# Altium schematic sheet sch_cm4_usb.SchDoc
size A4; SheetNumber: 7; SheetTotal: 7
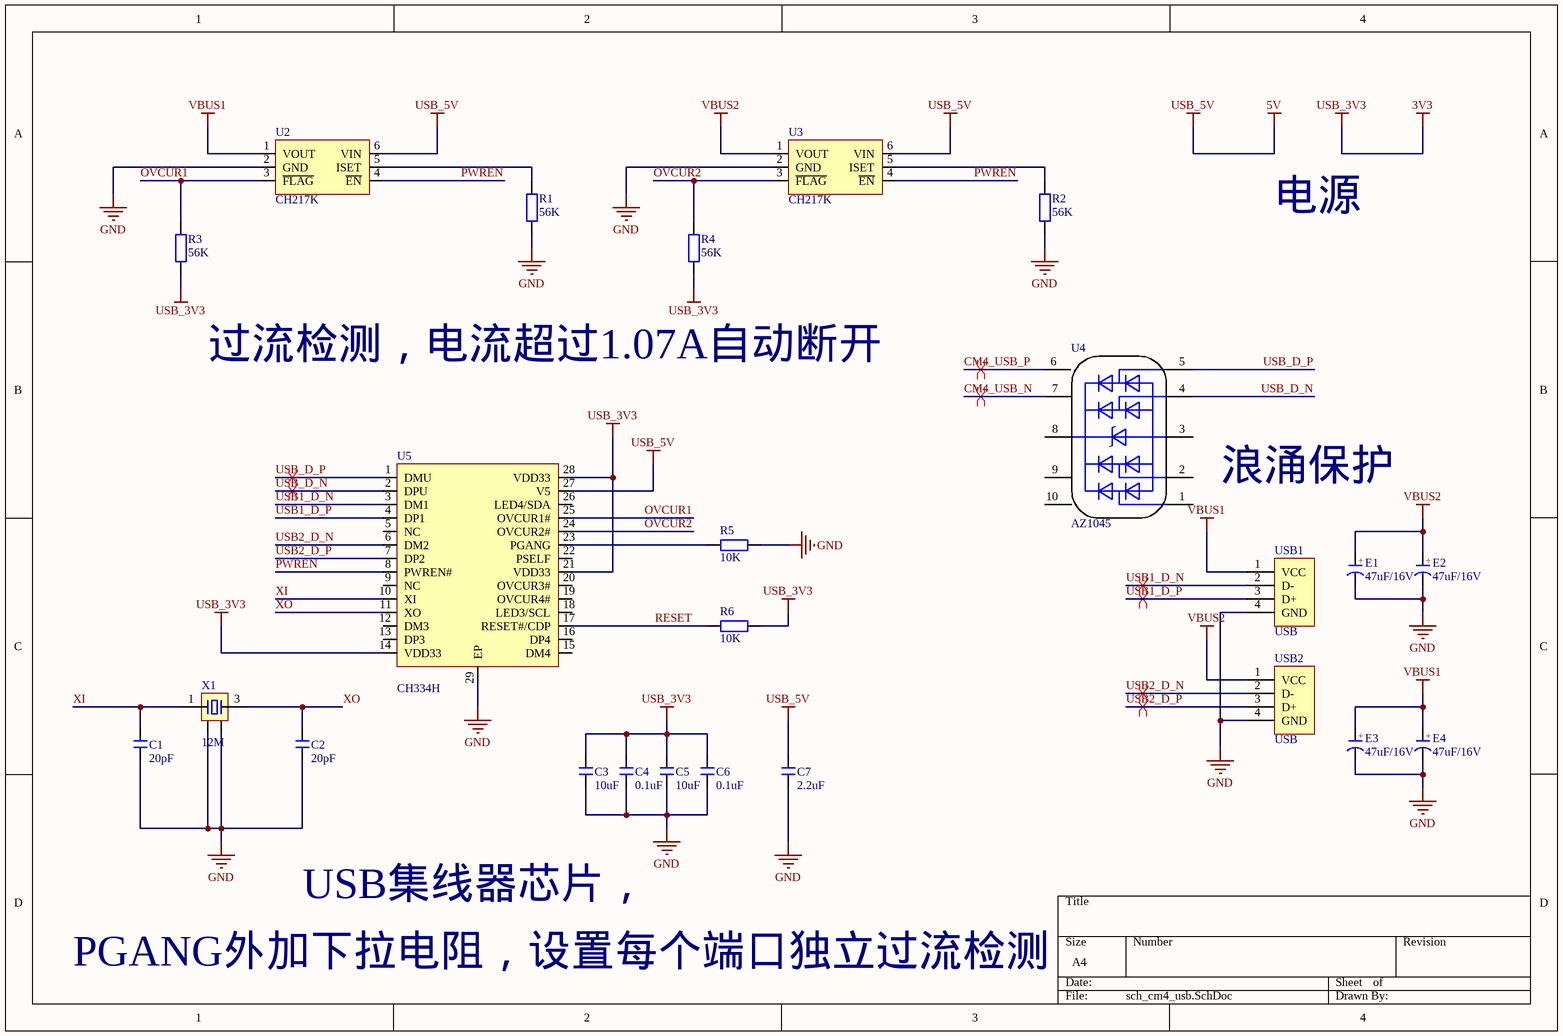
[diagram p0: sch_cm4_usb.SchDoc]

## Parts
C1  20pF  [C 0402_L]
C2  20pF  [C 0402_L]
C3  10uF  [C 0402_L]
C4  0.1uF  [C 0402_L]
C5  10uF  [C 0402_L]
C6  0.1uF  [C 0402_L]
C7  2.2uF  [C 0402_L]
E1  47uF/16V  [CD B(3528)]
E2  47uF/16V  [CD B(3528)]
E3  47uF/16V  [CD B(3528)]
E4  47uF/16V  [CD B(3528)]
R1  56K  [R 0603_L]
R2  56K  [R 0603_L]
R3  56K  [R 0603_L]
R4  56K  [R 0603_L]
R5  10K  [R 0402_L]
R6  10K  [R 0402_L]
U2  CH217K  [CH217K]
U3  CH217K  [CH217K]
U4  AZ1045  [AZ1045-04F]
U5  CH334H  [CH334H]
USB1  USB  [USB-A/S_F]
USB2  USB  [USB-A/S_F]
X1  12M  [OSC 2025-4P]

## Nets
3V3: C3.2 C4.2 C5.2 C6.2 R3.1 R4.1 R6.2 U5.14(VDD33) U5.21(VDD33) U5.28(VDD33)  [also labelled USB_3V3]
5V: C7.2 U2.6(VIN) U3.6(VIN) U5.27(V5)  [also labelled USB_5V]
GND: C1.1 C2.1 C3.1 C4.1 C5.1 C6.1 C7.1 E1.2(K) E2.2(K) E3.2(K) E4.2(K) R1.1 R2.1 R5.2 U2.2(GND) U3.2(GND) U5.29(EP) USB1.4(GND) USB2.4(GND) X1.2 X1.4
VBUS1: E3.1(A) E4.1(A) U2.1(VOUT) USB1.1(VCC)
VBUS2: E1.1(A) E2.1(A) U3.1(VOUT) USB2.1(VCC)
CM4_USB_N: U4.7(NC)
CM4_USB_P: U4.6(NC)
OVCUR1: R3.2 U2.3(~{FLAG}) U5.25(OVCUR1#)
OVCUR2: R4.2 U3.3(~{FLAG}) U5.24(OVCUR2#)
PWREN: U2.4(~{EN}) U3.4(~{EN}) U5.8(PWREN#)
RESET: R6.1 U5.17(RESET#/CDP)
USB1_D_N: U5.3(DM1) USB1.2(D-)
USB1_D_P: U5.4(DP1) USB1.3(D+)
USB2_D_N: U5.6(DM2) USB2.2(D-)
USB2_D_P: U5.7(DP2) USB2.3(D+)
USB_D_N: U4.4(I/O_3) U5.2(DPU)
USB_D_P: U4.5(I/O_4) U5.1(DMU)
XI: C1.2 U5.10(XI) X1.1
XO: C2.2 U5.11(XO) X1.3
NetR1_2: R1.2 U2.5(ISET)
NetR2_2: R2.2 U3.5(ISET)
NetR5_1: R5.1 U5.23(PGANG)

Not connected (* = marked no-connect by the designer): U4 1(I/O_1) 2(I/O_2) 3(GND) 8(GND) 9(NC) 10(NC); U5 5(NC) 9(NC) 12(DM3) 13(DP3) 15(DM4) 16(DP4) 18(LED3/SCL) 19(OVCUR4#) 20(OVCUR3#) 22(PSELF) 26(LED4/SDA)

## Layout directives
differential pair: CM4_USB_N, CM4_USB_P, USB1_D_N, USB1_D_P, USB2_D_N, USB2_D_P, USB_D_N, USB_D_P

## Notes on the sheet
- 电源
- 过流检测，电流超过1.07A自动断开
- 浪涌保护
- USB集线器芯片，
- PGANG外加下拉电阻，设置每个端口独立过流检测
- (in symbol CT) +

## Library data of the parts
C1-C7 = C: 贴片电容; BOM名称: 无极性贴片电容; 淘宝ID: 封装库来自淘宝 ID：黄晶宝石; 联系售后，技术支持: https://shop463601444.taobao.com; 唯一出售店铺网址: https://shop463601444.taobao.com
E1-E4 = CT: 贴片钽电容; 淘宝ID: 封装库来自淘宝 ID：黄晶宝石; BOM名称: 贴片钽电容; 联系售后: https://item.taobao.com/item.htm?id=566775463719
R1-R6 = R: 贴片电阻; 版权归属: 来自淘宝 ID：黄晶宝石; 封装库来自淘宝卖家 ID：黄晶宝石: 其他店铺购入均为盗版，不享受售后技术支持服务，请立即申请退款; BOM名称: 贴片电阻; 联系售后: https://item.taobao.com/item.htm?id=566775463719
U5 = CH334H: USB集线器
USB1 USB2 = USB-A/S: USB-A型母接口; BOM名称: USB-A型母接口; 学习资源: https://shop463601444.taobao.com
X1 = XTAL-4P: 4脚无源晶振; 版权归属: 封装库来自淘宝卖家 ID：黄晶宝石; BOM名称: 4脚无源晶振; 学习资源: https://shop463601444.taobao.com